# EAGLE design piBackpack (EAGLE 6.5.0)
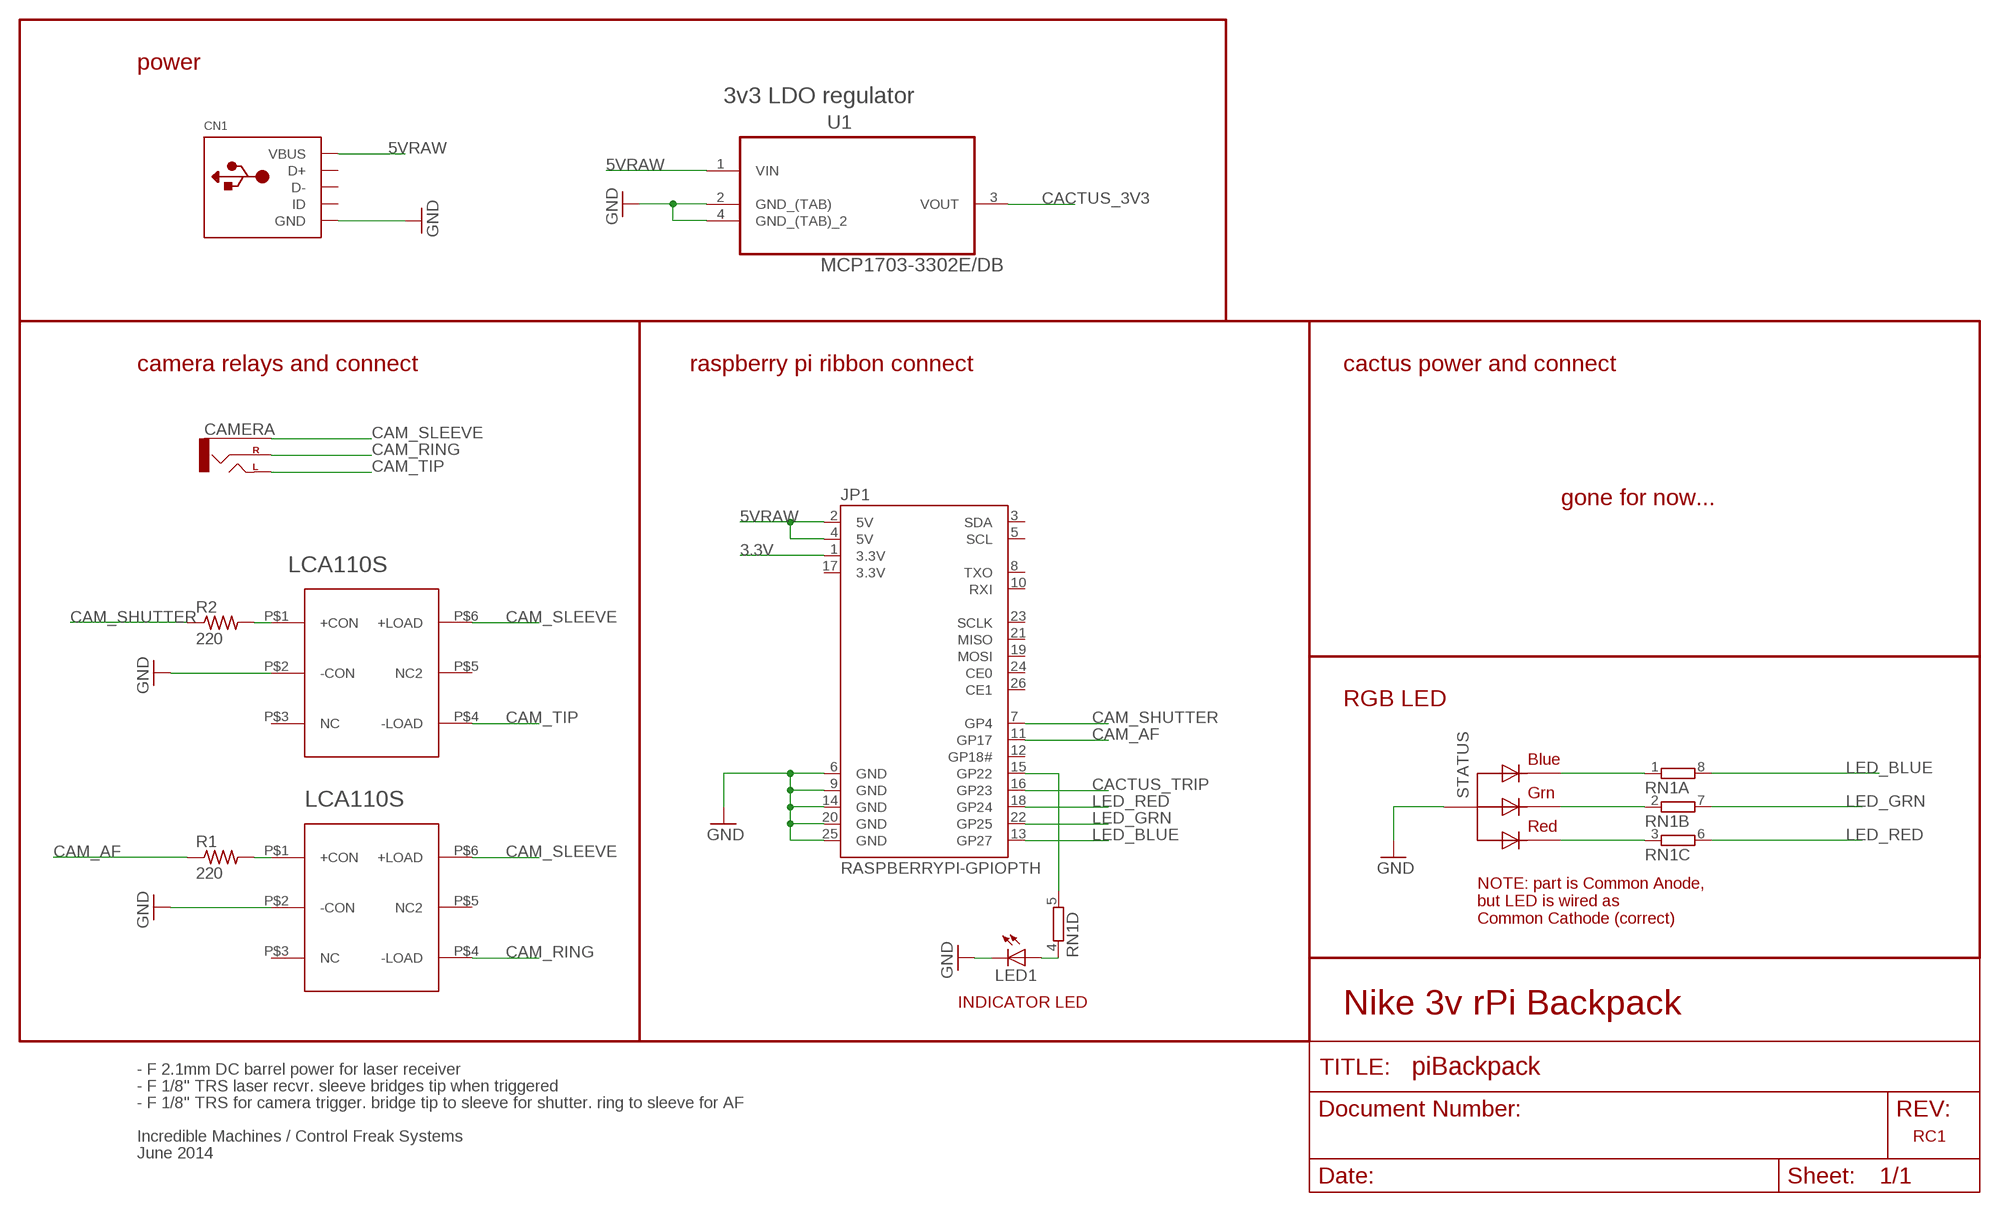
[diagram p0: schematic, sheet 1]

## Parts
CAMERA  AUDIO-JACKPTH  [AUDIO-JACK]
CN1  USBMOLEX  [USB-MINIB-THM-MOLEX]
JP1  RASPBERRYPI-GPIOPTH  [2X13-SHROUDED]
LCA110S  LCA110S  [6-SMD]
LCA110S1  LCA110S  [6-SMD]
LED1  LED3MM  [LED3MM]
R1  220  R-US_0204/5  [0204/5]
R2  220  R-US_0204/5  [0204/5]
RN1  4R-NEXBS8V  [EXBS8V]
STATUS  RGBLED_CA-5MM  [LED5MMRGB]
U1  MCP1703-3302E/DB  [SOT230P700X180-4N]

## Nets
3.3V: JP1.1(3.3V)
5VRAW: CN1.VBUS JP1.2(5V) JP1.4(5V) U1.1(VIN)
CACTUS_3V3: U1.3(VOUT)
CACTUS_TRIP: JP1.16(GP23)
CAM_AF: JP1.11(GP17) R1.1
CAM_RING: CAMERA.RING(RIGHT) LCA110S.P$4(-LOAD)
CAM_SHUTTER: JP1.7(GP4) R2.1
CAM_SLEEVE: CAMERA.SLEEVE LCA110S1.P$6(+LOAD) LCA110S.P$6(+LOAD)
CAM_TIP: CAMERA.TIP(LEFT) LCA110S1.P$4(-LOAD)
GND: CN1.GND JP1.6(GND) JP1.9(GND) JP1.14(GND) JP1.20(GND) JP1.25(GND) LCA110S1.P$2(-CON) LCA110S.P$2(-CON) LED1.K(C) STATUS.2(VCC) U1.2(GND_(TAB)) U1.4(GND_(TAB)_2)
LED_BLUE: JP1.13(GP27) RN1.8
LED_GRN: JP1.22(GP25) RN1.7
LED_RED: JP1.18(GP24) RN1.6
N$1: RN1.1 STATUS.4(BLUE)
N$2: RN1.2 STATUS.3(GREEN)
N$3: RN1.3 STATUS.1(RED)
N$4: JP1.15(GP22) RN1.5
N$5: LED1.A RN1.4
N$6: LCA110S.P$1(+CON) R1.2
N$7: LCA110S1.P$1(+CON) R2.2
Unconnected: CN1.D+ CN1.D- CN1.ID JP1.3(SDA) JP1.5(SCL) JP1.8(TXO) JP1.10(RXI) JP1.12(GP18#) JP1.19(MOSI) JP1.21(MISO) JP1.23(SCLK) JP1.24(CE0) JP1.26(CE1) LCA110S1.P$3(NC) LCA110S1.P$5(NC2) LCA110S.P$3(NC) LCA110S.P$5(NC2)

## Notes on the sheet
- power
- 3v3 LDO regulator
- camera relays and connect | raspberry pi ribbon connect | cactus power and connect
- gone for now...
- LCA110S
- RGB LED
- LCA110S
- NOTE: part is Common Anode,
  but LED is wired as 
  Common Cathode (correct)
- INDICATOR LED
- Nike 3v rPi Backpack
- - F 2.1mm DC barrel power for laser receiver
- - F 1/8" TRS laser recvr. sleeve bridges tip when triggered
- - F 1/8" TRS for camera trigger. bridge tip to sleeve for shutter. ring to sleeve for AF
- Incredible Machines / Control Freak Systems | RC1
- June 2014

## Power pins joined to a net without a drawn wire
3.3V: JP1.17(3.3V)

## Library data of the parts
CAMERA = SparkFun-Connectors:AUDIO-JACK: 3.5mm Audio Jack Simple 3.5mm common PCB mount audio jack. SKU: PRT-08032
CN1 = adafruit:USB: USB Connectors USBMINIB - Surface Mount Female Mini-B USB Connector 4UConnector: 06564 By microbuilder.eu Thru-hole RA Female Mini-B USB Connector 4UConnector: 18732 By ladyada.net
JP1 = SparkFun-Boards:RASPBERRYPI-GPIO: RASPBERRY PI I/O HEADER As defined for the Revistion 2 Pi.; DIST: sparkfun; DIST_ID: PRT-11490
LCA110S LCA110S1 = jmsaavedra:LCA110S: LCA110S Solid State Relay 6-pin SMT http://www.clare.com/home/pdfs.nsf/www/LCA110.pdf/$file/LCA110.pdf Digikey: CLA102CT-ND
LED1 = adafruit:LED: LED OSRAM: - CHIPLED LG R971, LG N971, LY N971, LG Q971, LY Q971, LO R971, LY R971 LH N974, LH R974 LS Q976, LO Q976, LY Q976 LO Q996 - Hyper CHIPLED LW Q18S LB Q993, LB Q99A, LB R99A - SideLED LS A670, LO A670, LY A670, LG A670, LP A670 LB A673, LV A673, LT A673, LW A673 LH A674 LY A675 LS A676, LA A676, LO A676, LY A676, LW A676 LS A679, LY A679, LG A679 - Hyper Micro SIDELED® LS Y876, LA Y876, LO Y876, LY Y876 LT Y87S - SmartLED LW L88C, LW L88S LB L89C, LB L89S, LG L890 LS L89K, LO L89K, LY L89K LS L896, LA L896, LO L896, LY L896 - TOPLED LS T670, LO T670, LY T670, LG T670, LP T670 LSG T670, LSP T670, LSY T670, LOP T670, LYG T670 LG T671, LOG T671, LSG T671 LB T673, LV T673, LT T673, LW T673 LH T674 LS T676, LA T676, LO T676, LY T676, LB T676, LH T676, LSB T676, LW T676 LB T67C, LV T67C, LT T67C, LS T67K, LO T67K, LY T67K, LW E67C LS E67B, LA E67B, LO E67B, LY E67B, LB E67C, LV E67C, LT E67C LW T67C LS T679, LY T679, LG T679 LS T770, LO T770, LY T770, LG T770, LP T770 LB T773, LV T773, LT T773, LW T773 LH T774 LS E675, LA E675, LY E675, LS T675 LS T776, LA T776, LO T776, LY T776, LB T776 LHGB T686 LT T68C, LB T68C - Hyper Mini TOPLED® LB M676 - Mini TOPLED Santana® LG M470 LS M47K, LO M47K, LY M47K Source: http://www.osram.convergy.de/
R1 R2 = resistor:R-US_: RESISTOR, American symbol
RN1 = resistor-dil:4R-N: Array Chip Resistor Source: RS Component / Phycomp; OC_FARNELL: unknown; OC_NEWARK: unknown
STATUS = adafruit:RGBLED_CA: RGB LED, common-anode 5MM Staggered pins 5mm Piranha package http://www.ladyada.net/library/pcb/eaglelibrary.html
U1 = Microchip_By_element14_Batch_1:MCP1703-3302E/DB: IC REG LDO 3.3V 250MA; MPN: MCP1703-3302E/DB; OC_FARNELL: 1627177; OC_NEWARK: 40M0623; PACKAGE: SOT-223-3; SUPPLIER: Microchip

## Net classes
1 VCC: width 0.381 mm

## Board
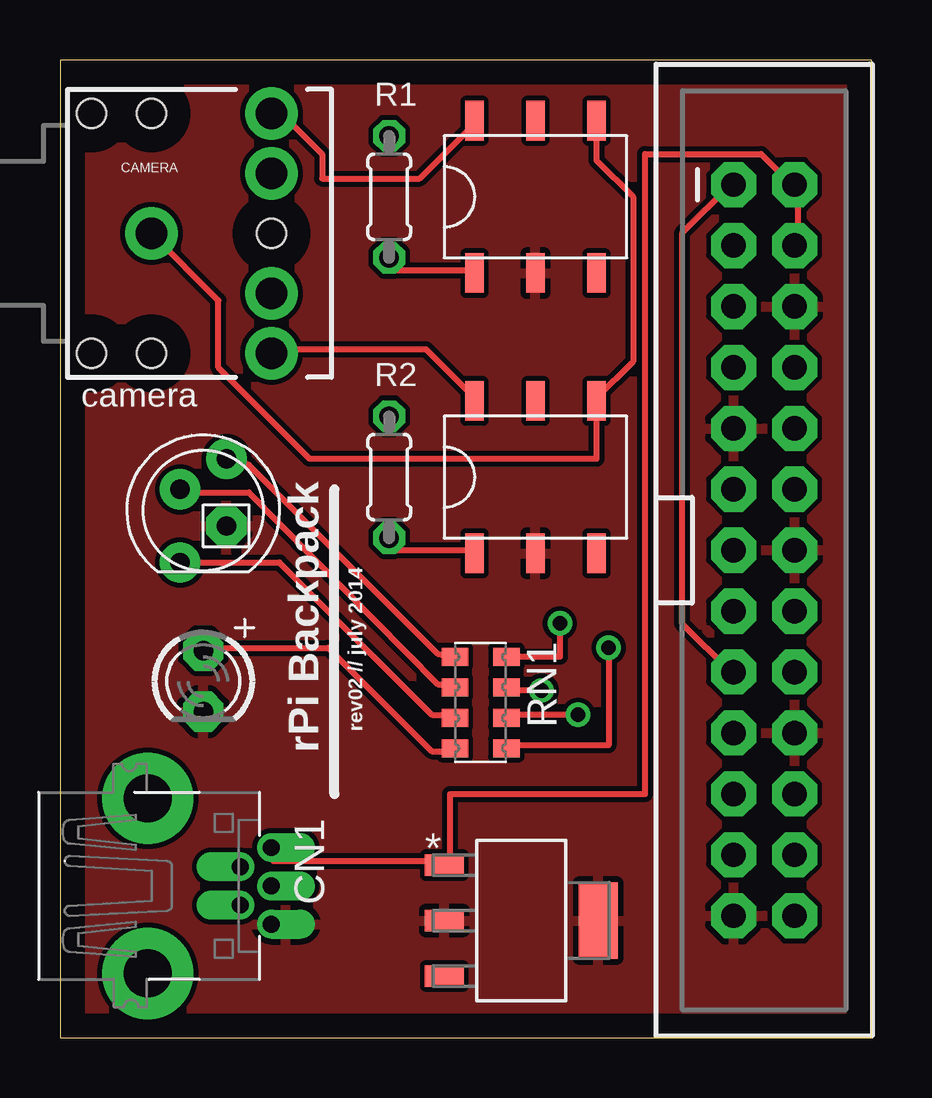
[diagram p1: board, top side]
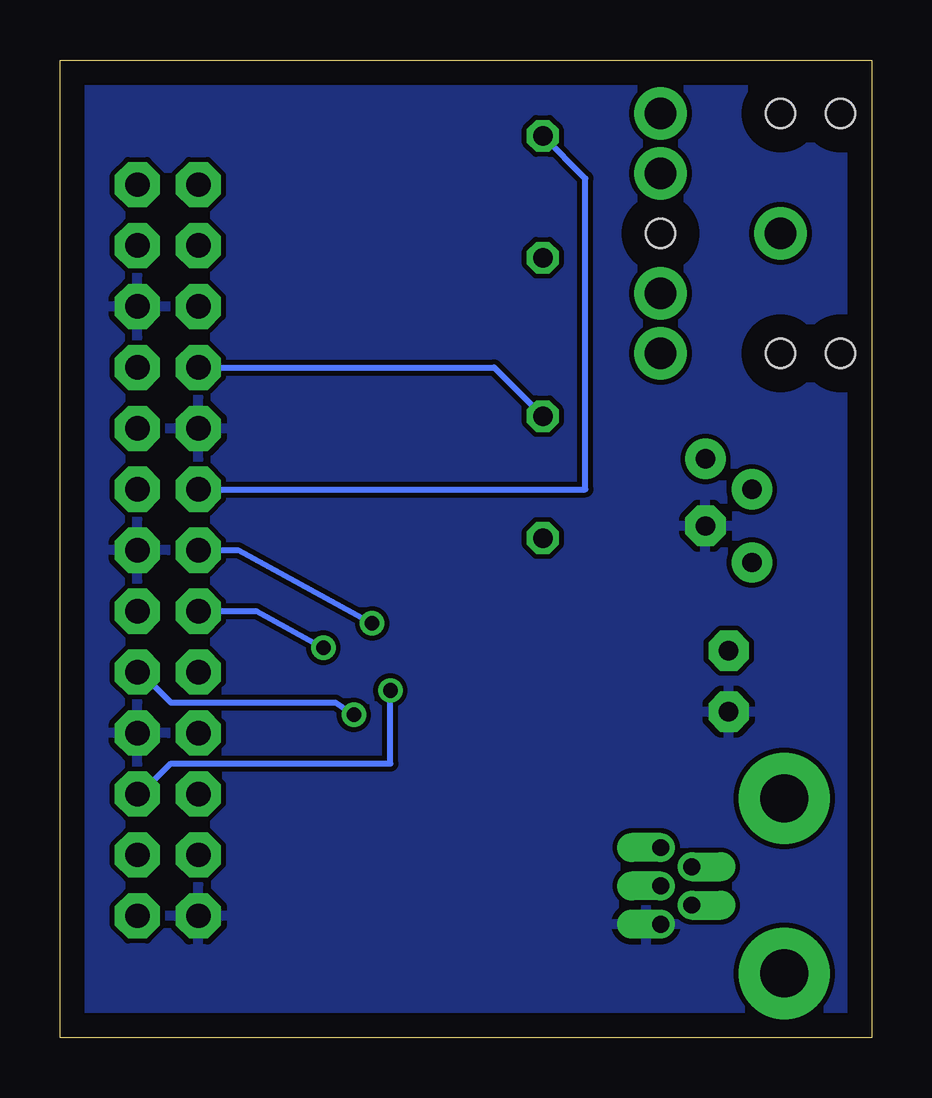
[diagram p2: board, bottom side, seen from below]

Size 33.83 x 40.76 mm. Coordinates in mm from the lower left corner, seen from the top.
Outline: 0,0 33.83,0 33.83,40.76 0,40.76 0,0
Copper layers (1*16): Top 0.035mm / dielectric 1.5mm / Bottom 0.035mm
Design rules "default": minimum track width 10mil, minimum drill 24mil, track to track 8mil, track to pad 8mil, pad to pad 8mil, via to via 8mil, smd to smd 8mil, copper to edge 40mil, drill to drill 8mil, minimum pad ring 10mil, minimum via ring 8mil, stop-mask expansion 4mil, vias tented up to drill 0mil, thermal gap 10mil
Holes 2.54 mm at 83.1,23.89 78.96,13.3

### Footprints (pad centres in the part's own frame; a part is rotated, then mirrored left to right if it is on the bottom)
AUDIO-JACK = drill 1.3 pad 2.184: RING 5,5; RSH 5,2.5; SLEEVE 0,0; TIP 5,-5; TSH 5,-2.5 | hole 1.2: 0,5; -2.5,5; -2.5,-5; 0,-5; 5,0
USB-MINIB-THM-MOLEX = drill 0.7 offset: D+ 0,9.72; D- -0.8,8.42; GND 1.6,9.72; ID 0.8,8.42; VBUS -1.6,9.72 | drill 2 pad 3.81: GND1 -3.65,4.57; GND4 3.65,4.57
2X13-SHROUDED = drill 1.016 pad 1.88 octagon: 1 -1.27,15.24; 2 1.27,15.24; 3 -1.27,12.7; 4 1.27,12.7; 5 -1.27,10.16; 6 1.27,10.16; 7 -1.27,7.62; 8 1.27,7.62; 9 -1.27,5.08; 10 1.27,5.08; 11 -1.27,2.54; 12 1.27,2.54; 13 -1.27,0; 14 1.27,0; 15 -1.27,-2.54; 16 1.27,-2.54; 17 -1.27,-5.08; 18 1.27,-5.08; 19 -1.27,-7.62; 20 1.27,-7.62; 21 -1.27,-10.16; 22 1.27,-10.16; 23 -1.27,-12.7; 24 1.27,-12.7; 25 -1.27,-15.24; 26 1.27,-15.24
6-SMD = smd 1.651 x 0.762: P$1 -3.175,2.54; P$2 -3.175,0; P$3 -3.175,-2.54; P$4 3.175,2.54; P$5 3.175,0; P$6 3.175,-2.54
LED3MM = drill 0.813 pad 1.676 octagon: A -1.27,0; K 1.27,0
0204/5 = drill 0.813 octagon: 1 -2.54,0; 2 2.54,0
EXBS8V = smd 0.75 x 1.1: 1 -1.905,-1.07; 2 -0.635,-1.07; 3 0.635,-1.07; 4 1.905,-1.07; 5 1.905,1.07; 6 0.635,1.07; 7 -0.635,1.07; 8 -1.905,1.07
LED5MMRGB = drill 0.8 pad 1.676: 1 -2.159,0.968; 3 0.889,0.968; 4 2.159,-0.968 | drill 0.8 pad 1.676 octagon: 2 -0.635,-0.968
SOT230P700X180-4N = smd 1.626 x 0.889: 1 -3.2,2.311; 2 -3.2,0; 3 -3.2,-2.311 | smd 1.626 x 3.175: 4 3.2,0

### Placement (x,y rotation side)
CAMERA  3.81,33.53 0 top
CN1  -0.92,6.33 270 top
JP1  29.34,20.32 0 top
LCA110S  19.81,35.05 90 top
LCA110S1  19.81,23.37 90 top
LED1  5.97,14.86 270 top
R1  13.72,35.05 270 top
R2  13.72,23.37 270 top
RN1  17.53,13.97 270 top
STATUS  5.97,21.97 90 top
U1  19.22,4.88 0 top

### Tracks (layer width: path | path; a pad name or v marks a point on that pad's centre or on a via)
3.3V
  Top 0.254: JP1.17 27.94,15.24 25.91,17.27 25.91,33.53 27.94,35.56 JP1.1
5VRAW
  Top 0.254: JP1.4 30.73,33.02 30.73,35.56 JP1.2 30.48,35.56 29.21,36.83 24.38,36.83 24.38,10.16 16.26,10.16 16.26,7.37 U1.1 16,7.37 8.89,7.37 8.89,7.87 CN1.VBUS
CAM_AF
  Bottom 0.254: R1.1 11.94,35.81 11.94,22.86 JP1.11
CAM_RING
  Top 0.254: LCA110S.P$4 17.27,38.1 14.99,35.81 10.92,35.81 10.92,36.83 9.4,38.35 8.89,38.35 CAMERA.RING
CAM_SHUTTER
  Bottom 0.254: R2.1 15.75,27.94 JP1.7
CAM_SLEEVE
  Top 0.254: LCA110S.P$6 22.35,36.58 23.88,35.05 23.88,28.19 22.35,26.67 LCA110S1.P$6 22.35,24.13 10.41,24.13 6.6,27.94 6.6,30.73 CAMERA.SLEEVE
CAM_TIP
  Top 0.254: LCA110S1.P$4 17.27,26.67 15.24,28.7 8.89,28.7 CAMERA.TIP
GND
  pour Bottom: -8.89,62.23 111.76,62.23 111.76,-3.81 -7.37,-3.56
  pour Top: -6.35,57.15 113.03,57.15 113.03,-5.08 -6.35,-5.08
LED_BLUE  (via drill 0.61)
  Top 0.254: v20.83,17.27 20.83,15.88 RN1.8
  Bottom 0.254: v20.83,17.27 26.42,20.32 JP1.13
LED_GRN  (via drill 0.61)
  Top 0.254: v20.07,14.48 18.8,14.48 RN1.7
  Bottom 0.254: v20.07,14.48 20.07,11.43 29.21,11.43 30.48,10.16 JP1.22
LED_RED  (via drill 0.61)
  Top 0.254: v21.59,13.46 18.8,13.46 RN1.6
  Bottom 0.254: v21.59,13.46 22.35,13.97 29.21,13.97 30.48,15.24 JP1.18
N$1
  Top 0.254: RN1.1 15.75,16 7.87,23.88 7.11,24.38 7.11,24.13 STATUS.4
N$2
  Top 0.254: RN1.2 16.26,14.73 15.75,14.73 7.87,22.73 5.08,22.73 5.08,22.86 STATUS.3
N$3
  Top 0.254: STATUS.1 9.14,19.81 15.49,13.46 16.26,13.46 RN1.3
N$4  (via drill 0.61)
  Top 0.254: v22.86,16.26 22.86,12.19 18.8,12.19 RN1.5
  Bottom 0.254: v22.86,16.26 25.65,17.78 JP1.15
N$5
  Top 0.254: RN1.4 16.26,11.94 15.49,11.94 11.18,16.26 6.1,16.26 LED1.A
N$6
  Top 0.254: R1.2 13.72,32 17.27,32 LCA110S.P$1
N$7
  Top 0.254: R2.2 13.72,20.32 17.27,20.32 LCA110S1.P$1

### Text on the board
tPlace: autofocus | shutter | camera | rPi Backpack | rev02 // july 2014 | pi